# EAGLE schematic v.0.0.1 (EAGLE 5.08)

## Sheet 1 of 7
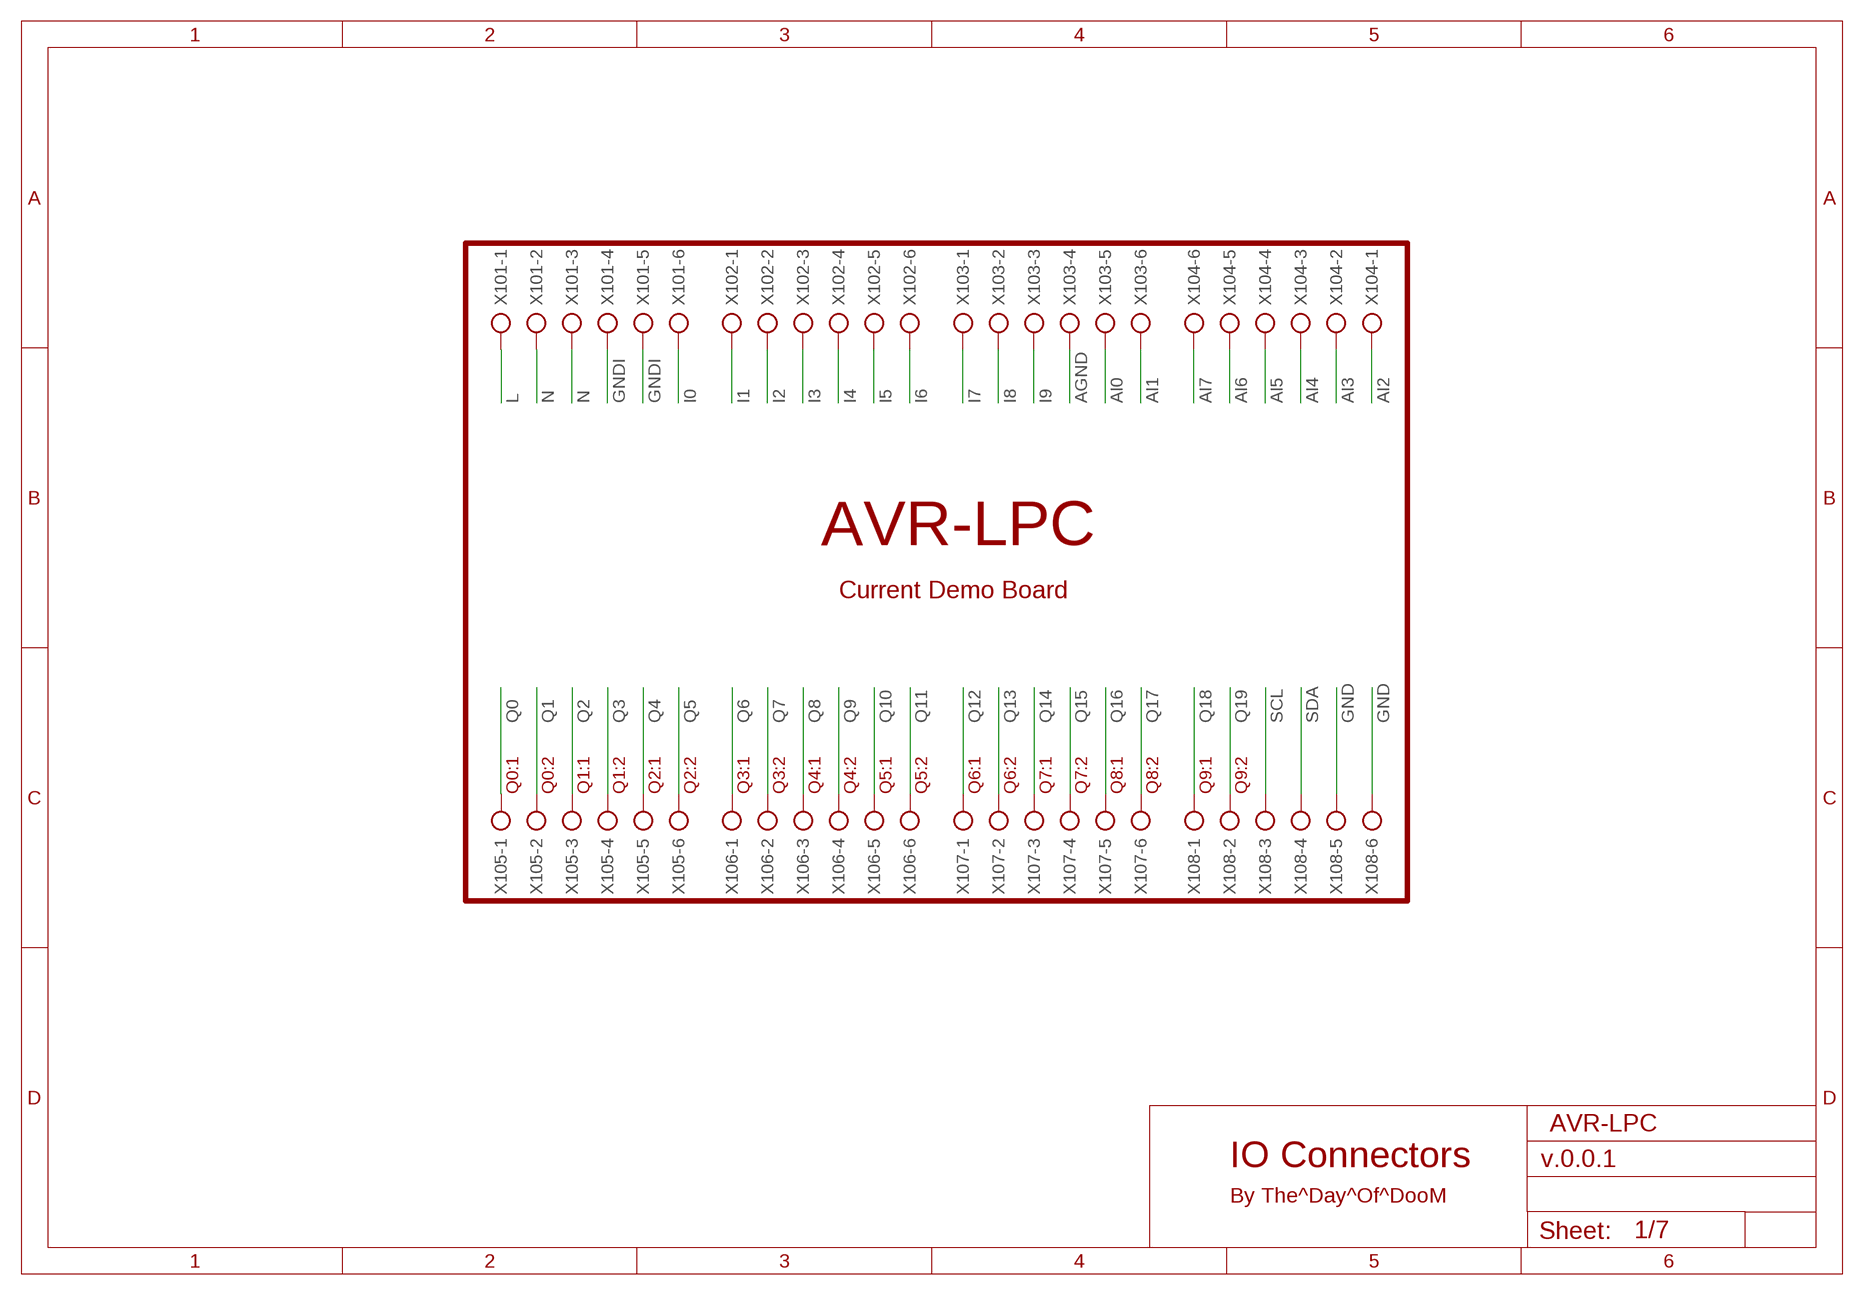
[diagram p0: schematic, sheet 1]

### Parts
X101  AK500/6  [AK500/6]
X102  AK500/6  [AK500/6]
X103  AK500/6  [AK500/6]
X104  AK500/6  [AK500/6]
X105  AK500/6  [AK500/6]
X106  AK500/6  [AK500/6]
X107  AK500/6  [AK500/6]
X108  AK500/6  [AK500/6]

### Nets
AGND: X103.4 ; also sheet 2,7
AI0: X103.5 ; also sheet 7
AI1: X103.6 ; also sheet 7
AI2: X104.1 ; also sheet 7
AI3: X104.2 ; also sheet 7
AI4: X104.3 ; also sheet 7
AI5: X104.4 ; also sheet 7
AI6: X104.5 ; also sheet 7
AI7: X104.6 ; also sheet 7
GND: X108.5 X108.6 ; also sheet 2,3,4,5,6
GNDI: X101.4 X101.5 ; also sheet 2,5
I0: X101.6 ; also sheet 5
I1: X102.1 ; also sheet 5
I2: X102.2 ; also sheet 5
I3: X102.3 ; also sheet 5
I4: X102.4 ; also sheet 5
I5: X102.5 ; also sheet 5
I6: X102.6 ; also sheet 5
I7: X103.1 ; also sheet 5
I8: X103.2 ; also sheet 5
I9: X103.3 ; also sheet 5
L: X101.1 ; also sheet 2
N: X101.2 X101.3 ; also sheet 2
Q0: X105.1 ; also sheet 6
Q1: X105.2 ; also sheet 6
Q2: X105.3 ; also sheet 6
Q3: X105.4 ; also sheet 6
Q4: X105.5 ; also sheet 6
Q5: X105.6 ; also sheet 6
Q6: X106.1 ; also sheet 6
Q7: X106.2 ; also sheet 6
Q8: X106.3 ; also sheet 6
Q9: X106.4 ; also sheet 6
Q10: X106.5 ; also sheet 6
Q11: X106.6 ; also sheet 6
Q12: X107.1 ; also sheet 6
Q13: X107.2 ; also sheet 6
Q14: X107.3 ; also sheet 6
Q15: X107.4 ; also sheet 6
Q16: X107.5 ; also sheet 6
Q17: X107.6 ; also sheet 6
Q18: X108.1 ; also sheet 6
Q19: X108.2 ; also sheet 6
SCL: X108.3 ; also sheet 4
SDA: X108.4 ; also sheet 4

### Notes on the sheet
- AVR-LPC
- Current Demo Board
- Q0:1 | Q0:2 | Q1:1 | Q1:2 | Q2:1 | Q2:2 | Q3:1 | Q3:2 | Q4:1 | Q4:2 | Q5:1 | Q5:2 | Q6:1 | Q6:2 | Q7:1 | Q7:2 | Q8:1 | Q8:2 | Q9:1 | Q9:2
- AVR-LPC
- IO Connectors
- By The^Day^Of^DooM

## Sheet 2 of 7
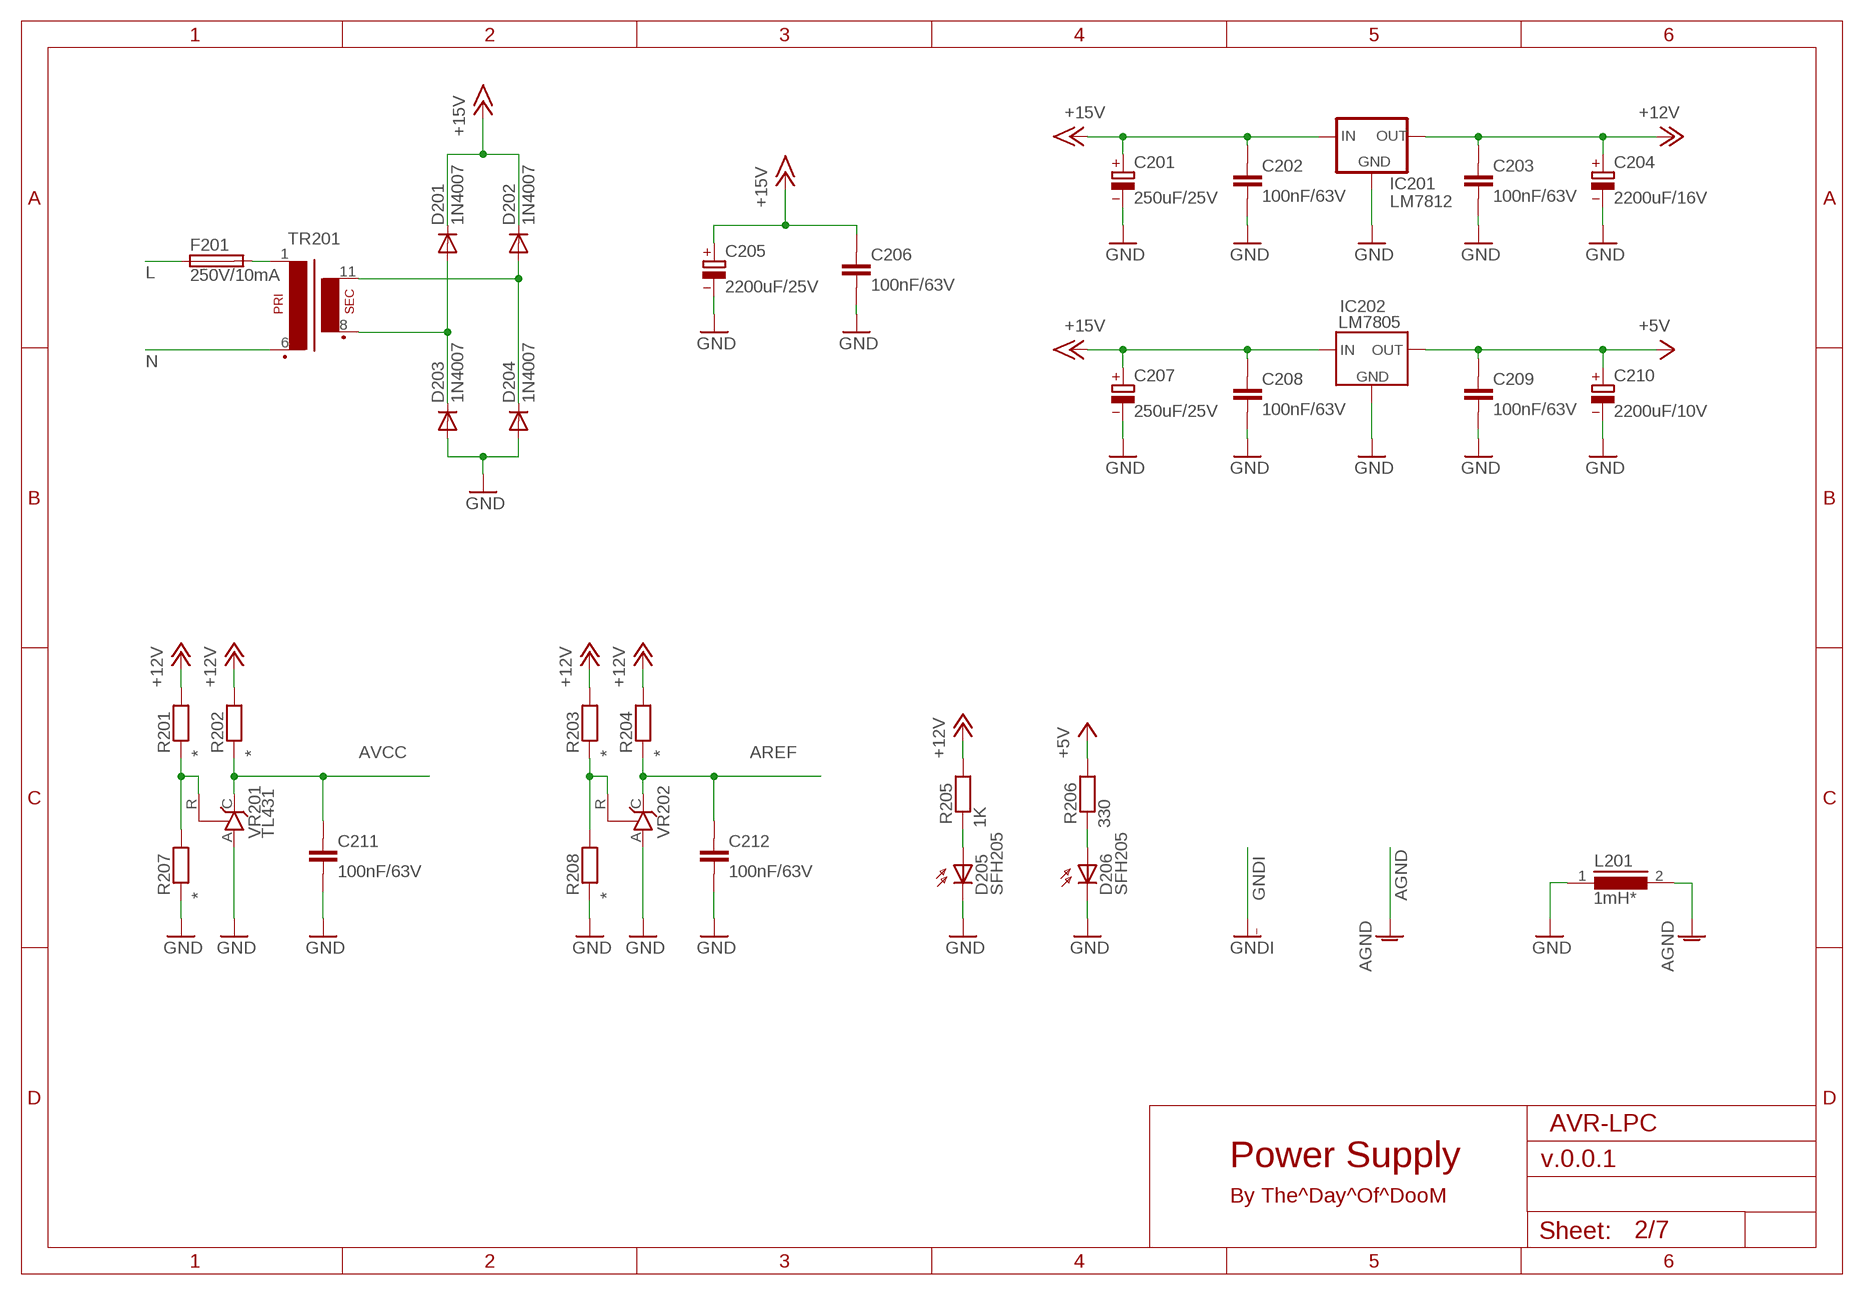
[diagram p1: schematic, sheet 2]

### Parts
C201  250uF/25V  CPOL-EU_Ø250  [CP100X80X24]
C202  100nF/63V  C-EU_3  [C200X100X24]
C203  100nF/63V  C-EU_3  [C200X100X24]
C204  2200uF/16V  CPOL-EU_Ø500Ø400Ø300  [CP500/300X100X24]
C205  2200uF/25V  CPOL-EU_Ø500Ø400Ø300  [CP500/300X100X24]
C206  100nF/63V  C-EU_3  [C200X100X24]
C207  250uF/25V  CPOL-EU_Ø250  [CP100X80X24]
C208  100nF/63V  C-EU_3  [C200X100X24]
C209  100nF/63V  C-EU_3  [C200X100X24]
C210  2200uF/10V  CPOL-EU_Ø500Ø400Ø300  [CP500/300X100X24]
C211  100nF/63V  C-EU_3  [C200X100X24]
C212  100nF/63V  C-EU_3  [C200X100X24]
D201  1N4007  1N4007H  [400X100]
D202  1N4007  1N4007H  [400X100]
D203  1N4007  1N4007H  [400X100]
D204  1N4007  1N4007H  [400X100]
D205  SFH205  [SFH205]
D206  SFH205  [SFH205]
F201  250V/10mA  GSH15  [GSH15]
IC201  LM7812  78XXS  [78XXS]
IC202  LM7805  78XXSC1  [78XX_VERTICAL_COOLER]
L201  1mH*  MICC12  [MICC12]
R201  *  R-EU_2  [R100X86X24]
R202  *  R-EU_2  [R100X86X24]
R203  *  R-EU_2  [R100X86X24]
R204  *  R-EU_2  [R100X86X24]
R205  1K  R-EU_5  [R300X100X24]
R206  330  R-EU_5  [R300X100X24]
R207  *  R-EU_2  [R100X86X24]
R208  *  R-EU_2  [R100X86X24]
TR201  EI48-1  [EI48-1]
VR201  TL431  TL431CLP  [TO92-CLP]
VR202  TL431CLP  [TO92-CLP]

### Nets
+5V: C209.P$1 C210.+ IC202.OUT R206.P$2 ; also sheet 3,4,5
+12V: C203.P$1 C204.+ IC201.OUT R201.P$2 R202.P$2 R203.P$2 R204.P$2 R205.P$2 ; also sheet 7
+15V: C201.+ C202.P$1 C205.+ C206.P$1 C207.+ C208.P$1 D201.C D202.C IC201.IN IC202.IN ; also sheet 6
AGND: L201.2 ; also sheet 1,7
AREF: C212.P$1 R204.P$1 VR202.C ; also sheet 3,4
AVCC: C211.P$1 R202.P$1 VR201.C ; also sheet 3,4
GND: C201.- C202.P$2 C203.P$2 C204.- C205.- C206.P$2 C207.- C208.P$2 C209.P$2 C210.- C211.P$2 C212.P$2 D203.A D204.A D205.K(C) D206.K(C) IC201.GND IC202.GND L201.1 R207.P$1 R208.P$1 VR201.A VR202.A ; also sheet 1,3,4,5,6
L: F201.1 ; also sheet 1
N: TR201.6(P2) ; also sheet 1
N$1: F201.2 TR201.1
N$2: D201.A D203.C TR201.8(S3)
N$3: R201.P$1 R207.P$2 VR201.R
N$5: D202.A D204.C TR201.11(S4)
N$7: R203.P$1 R208.P$2 VR202.R
N$20: D205.A R205.P$1
N$34: D206.A R206.P$1

### Notes on the sheet
- AVR-LPC
- Power Supply
- By The^Day^Of^DooM

## Sheet 3 of 7
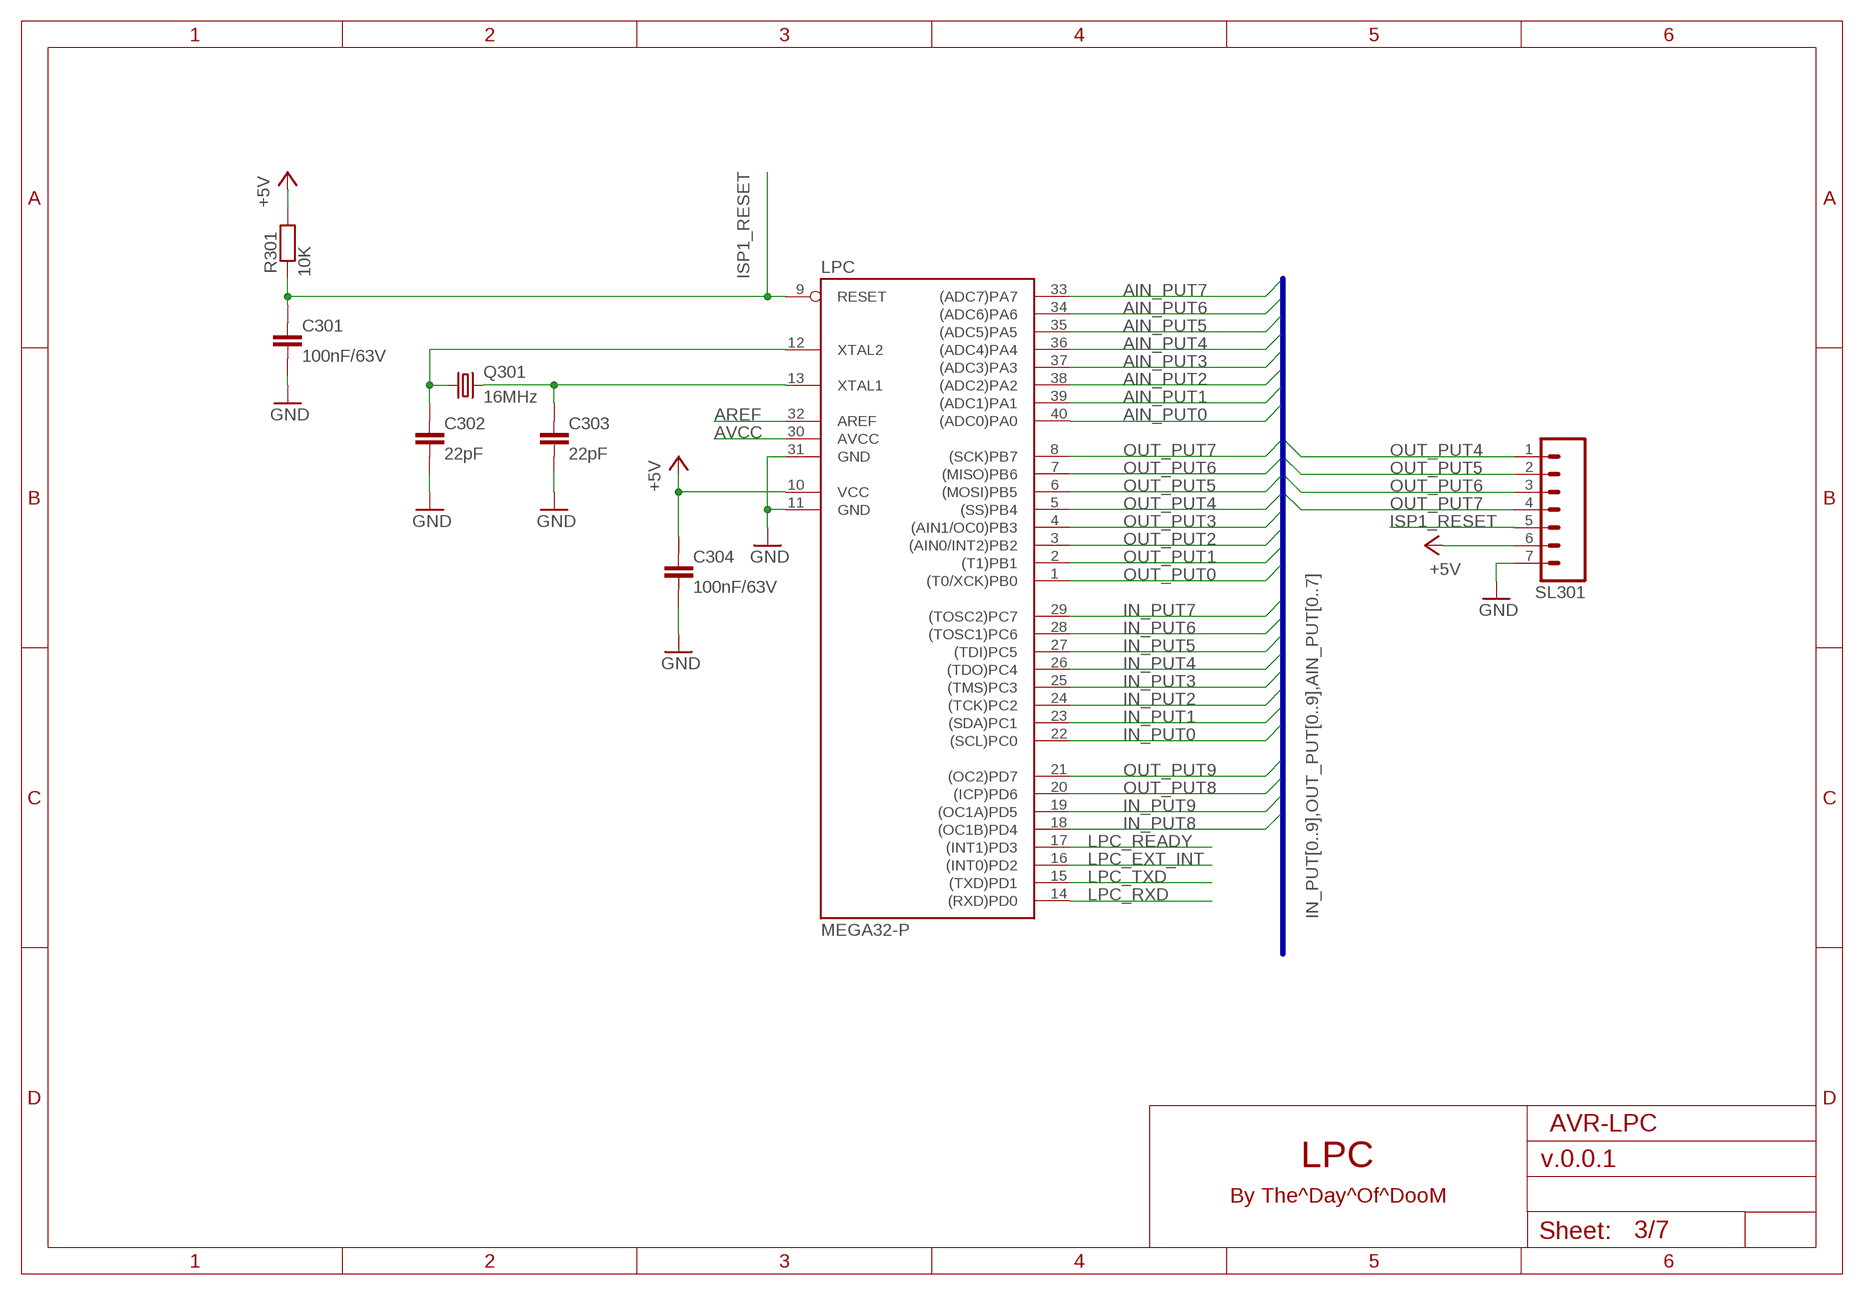
[diagram p2: schematic, sheet 3]

### Parts
C301  100nF/63V  C-EU_3  [C200X100X24]
C302  22pF  C-EU_2  [C100X86X24]
C303  22pF  C-EU_2  [C100X86X24]
C304  100nF/63V  C-EU_3  [C200X100X24]
LPC  MEGA32-P  [DIL40]
Q301  16MHz  CRYSTALHC49U-V  [HC49U-V]
R301  10K  R-EU_2  [R100X86X24]
SL301  M07  [07P]

### Nets
+5V: C304.P$1 LPC.10(VCC) R301.P$2 SL301.6 ; also sheet 2,4,5
AIN_PUT0: LPC.40((ADC0)PA0) ; also sheet 7
AIN_PUT1: LPC.39((ADC1)PA1) ; also sheet 7
AIN_PUT2: LPC.38((ADC2)PA2) ; also sheet 7
AIN_PUT3: LPC.37((ADC3)PA3) ; also sheet 7
AIN_PUT4: LPC.36((ADC4)PA4) ; also sheet 7
AIN_PUT5: LPC.35((ADC5)PA5) ; also sheet 7
AIN_PUT6: LPC.34((ADC6)PA6) ; also sheet 7
AIN_PUT7: LPC.33((ADC7)PA7) ; also sheet 7
AREF: LPC.32(AREF) ; also sheet 2,4
AVCC: LPC.30(AVCC) ; also sheet 2,4
GND: C301.P$2 C302.P$2 C303.P$2 C304.P$2 LPC.11(GND) LPC.31(GND) SL301.7 ; also sheet 1,2,4,5,6
IN_PUT0: LPC.22((SCL)PC0) ; also sheet 5
IN_PUT1: LPC.23((SDA)PC1) ; also sheet 5
IN_PUT2: LPC.24((TCK)PC2) ; also sheet 5
IN_PUT3: LPC.25((TMS)PC3) ; also sheet 5
IN_PUT4: LPC.26((TDO)PC4) ; also sheet 5
IN_PUT5: LPC.27((TDI)PC5) ; also sheet 5
IN_PUT6: LPC.28((TOSC1)PC6) ; also sheet 5
IN_PUT7: LPC.29((TOSC2)PC7) ; also sheet 5
IN_PUT8: LPC.18((OC1B)PD4) ; also sheet 5
IN_PUT9: LPC.19((OC1A)PD5) ; also sheet 5
ISP1_RESET: C301.P$1 LPC.9(RESET) R301.P$1 SL301.5
LPC_EXT_INT: LPC.16((INT0)PD2) ; also sheet 4
LPC_READY: LPC.17((INT1)PD3) ; also sheet 4
LPC_RXD: LPC.14((RXD)PD0) ; also sheet 4
LPC_TXD: LPC.15((TXD)PD1) ; also sheet 4
N$6: C302.P$1 LPC.12(XTAL2) Q301.1
N$8: C303.P$1 LPC.13(XTAL1) Q301.2
OUT_PUT0: LPC.1((T0/XCK)PB0) ; also sheet 6
OUT_PUT1: LPC.2((T1)PB1) ; also sheet 6
OUT_PUT2: LPC.3((AIN0/INT2)PB2) ; also sheet 6
OUT_PUT3: LPC.4((AIN1/OC0)PB3) ; also sheet 6
OUT_PUT4: LPC.5((SS)PB4) SL301.1 ; also sheet 6
OUT_PUT5: LPC.6((MOSI)PB5) SL301.2 ; also sheet 6
OUT_PUT6: LPC.7((MISO)PB6) SL301.3 ; also sheet 6
OUT_PUT7: LPC.8((SCK)PB7) SL301.4 ; also sheet 6
OUT_PUT8: LPC.20((ICP)PD6) ; also sheet 6
OUT_PUT9: LPC.21((OC2)PD7) ; also sheet 6

### Buses
IN_PUT[0..9],OUT_PUT[0..9],AIN_PUT[0..7]

### Notes on the sheet
- AVR-LPC
- LPC
- By The^Day^Of^DooM

## Sheet 4 of 7
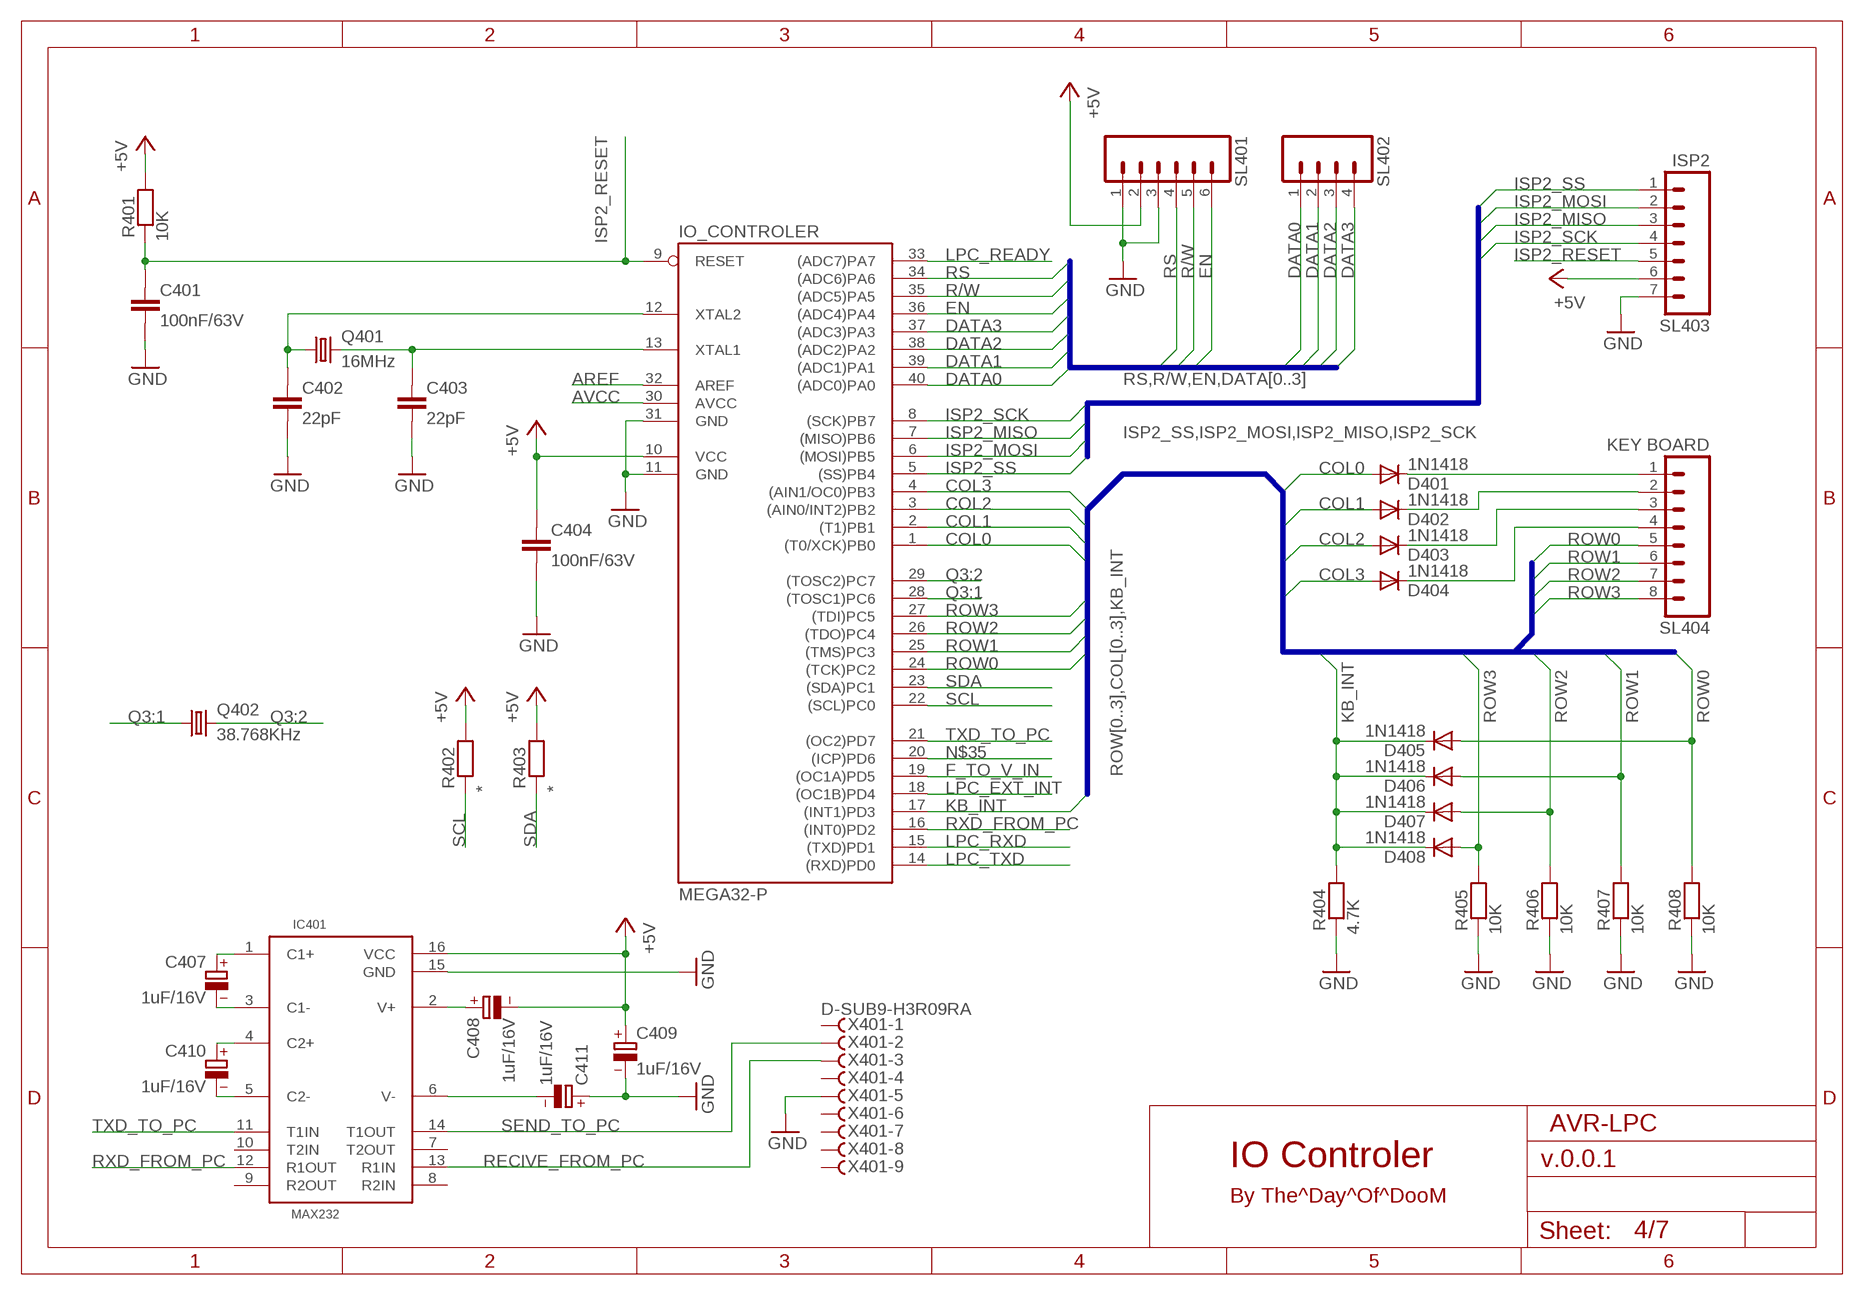
[diagram p3: schematic, sheet 4]

### Parts
C401  100nF/63V  C-EU_3  [C200X100X24]
C402  22pF  C-EU_2  [C100X86X24]
C403  22pF  C-EU_2  [C100X86X24]
C404  100nF/63V  C-EU_3  [C200X100X24]
C407  1uF/16V  CPOL-EU_Ø250  [CP100X80X24]
C408  1uF/16V  CPOL-EU_Ø250  [CP100X80X24]
C409  1uF/16V  CPOL-EU_Ø250  [CP100X80X24]
C410  1uF/16V  CPOL-EU_Ø250  [CP100X80X24]
C411  1uF/16V  CPOL-EU_Ø250  [CP100X80X24]
D401  1N1418  DIODE-D-7.5  [D-7.5]
D402  1N1418  DIODE-D-7.5  [D-7.5]
D403  1N1418  DIODE-D-7.5  [D-7.5]
D404  1N1418  DIODE-D-7.5  [D-7.5]
D405  1N1418  DIODE-D-7.5  [D-7.5]
D406  1N1418  DIODE-D-7.5  [D-7.5]
D407  1N1418  DIODE-D-7.5  [D-7.5]
D408  1N1418  DIODE-D-7.5  [D-7.5]
IC401  MAX232  [DIL16]
IO_CONTROLER  MEGA32-P  [DIL40]
Q401  16MHz  CRYSTALHC49U-V  [HC49U-V]
Q402  38.768KHz  CRYSTALTC26V  [TC26V]
R401  10K  R-EU_2  [R100X86X24]
R402  *  R-EU_5  [R300X100X24]
R403  *  R-EU_5  [R300X100X24]
R404  4.7K  R-EU_1  [R100X80X24]
R405  10K  R-EU_2  [R100X86X24]
R406  10K  R-EU_2  [R100X86X24]
R407  10K  R-EU_2  [R100X86X24]
R408  10K  R-EU_2  [R100X86X24]
SL401  M06  [06P]
SL402  M04  [04P]
SL403  ISP2  M07  [07P]
SL404  KEY BOARD  M08  [08P]
X401  D-SUB9-H3R09RA  [H3R09RA]

### Nets
+5V: C404.P$1 C408.- C409.+ IC401.16(VCC) IO_CONTROLER.10(VCC) R401.P$2 R402.P$2 R403.P$2 SL401.2 SL403.6 ; also sheet 2,3,5
AREF: IO_CONTROLER.32(AREF) ; also sheet 2,3
AVCC: IO_CONTROLER.30(AVCC) ; also sheet 2,3
COL0: D401.A IO_CONTROLER.1((T0/XCK)PB0)
COL1: D402.A IO_CONTROLER.2((T1)PB1)
COL2: D403.A IO_CONTROLER.3((AIN0/INT2)PB2)
COL3: D404.A IO_CONTROLER.4((AIN1/OC0)PB3)
DATA0: IO_CONTROLER.40((ADC0)PA0) SL402.1
DATA1: IO_CONTROLER.39((ADC1)PA1) SL402.2
DATA2: IO_CONTROLER.38((ADC2)PA2) SL402.3
DATA3: IO_CONTROLER.37((ADC3)PA3) SL402.4
EN: IO_CONTROLER.36((ADC4)PA4) SL401.6
F_TO_V_IN: IO_CONTROLER.19((OC1A)PD5)
GND: C401.P$2 C402.P$2 C403.P$2 C404.P$2 C409.- C411.+ IC401.15(GND) IO_CONTROLER.11(GND) IO_CONTROLER.31(GND) R404.P$1 R405.P$1 R406.P$1 R407.P$1 R408.P$1 SL401.1 SL401.3 SL403.7 X401.5 ; also sheet 1,2,3,5,6
ISP2_MISO: IO_CONTROLER.7((MISO)PB6) SL403.3
ISP2_MOSI: IO_CONTROLER.6((MOSI)PB5) SL403.2
ISP2_RESET: C401.P$1 IO_CONTROLER.9(RESET) R401.P$1 SL403.5
ISP2_SCK: IO_CONTROLER.8((SCK)PB7) SL403.4
ISP2_SS: IO_CONTROLER.5((SS)PB4) SL403.1
KB_INT: D405.C D406.C D407.C D408.C IO_CONTROLER.17((INT1)PD3) R404.P$2
LPC_EXT_INT: IO_CONTROLER.18((OC1B)PD4) ; also sheet 3
LPC_READY: IO_CONTROLER.33((ADC7)PA7) ; also sheet 3
LPC_RXD: IO_CONTROLER.15((TXD)PD1) ; also sheet 3
LPC_TXD: IO_CONTROLER.14((RXD)PD0) ; also sheet 3
N$4: C407.- IC401.3(C1-)
N$9: C407.+ IC401.1(C1+)
N$10: C402.P$1 IO_CONTROLER.12(XTAL2) Q401.1
N$11: C403.P$1 IO_CONTROLER.13(XTAL1) Q401.2
N$12: C410.- IC401.5(C2-)
N$13: C410.+ IC401.4(C2+)
N$14: C408.+ IC401.2(V+)
N$15: D401.C SL404.1
N$16: D402.C SL404.2
N$17: D403.C SL404.3
N$18: D404.C SL404.4
N$19: C411.- IC401.6(V-)
N$35: IO_CONTROLER.20((ICP)PD6)
Q3:1: IO_CONTROLER.28((TOSC1)PC6) Q402.1
Q3:2: IO_CONTROLER.29((TOSC2)PC7) Q402.2
R/W: IO_CONTROLER.35((ADC5)PA5) SL401.5
RECIVE_FROM_PC: IC401.13(R1IN) X401.3
ROW0: D405.A IO_CONTROLER.24((TCK)PC2) R408.P$2 SL404.5
ROW1: D406.A IO_CONTROLER.25((TMS)PC3) R407.P$2 SL404.6
ROW2: D407.A IO_CONTROLER.26((TDO)PC4) R406.P$2 SL404.7
ROW3: D408.A IO_CONTROLER.27((TDI)PC5) R405.P$2 SL404.8
RS: IO_CONTROLER.34((ADC6)PA6) SL401.4
RXD_FROM_PC: IC401.12(R1OUT) IO_CONTROLER.16((INT0)PD2)
SCL: IO_CONTROLER.22((SCL)PC0) R402.P$1 ; also sheet 1
SDA: IO_CONTROLER.23((SDA)PC1) R403.P$1 ; also sheet 1
SEND_TO_PC: IC401.14(T1OUT) X401.2
TXD_TO_PC: IC401.11(T1IN) IO_CONTROLER.21((OC2)PD7)
Unconnected: IC401.7(T2OUT) IC401.8(R2IN) IC401.9(R2OUT) IC401.10(T2IN) X401.1 X401.4 X401.6 X401.7 X401.8 X401.9

### Buses
ROW[0..3],COL[0..3],KB_INT
RS,R/W,EN,DATA[0..3]
ISP2_SS,ISP2_MOSI,ISP2_MISO,ISP2_SCK

### Notes on the sheet
- AVR-LPC
- IO Controler
- By The^Day^Of^DooM

## Sheet 5 of 7
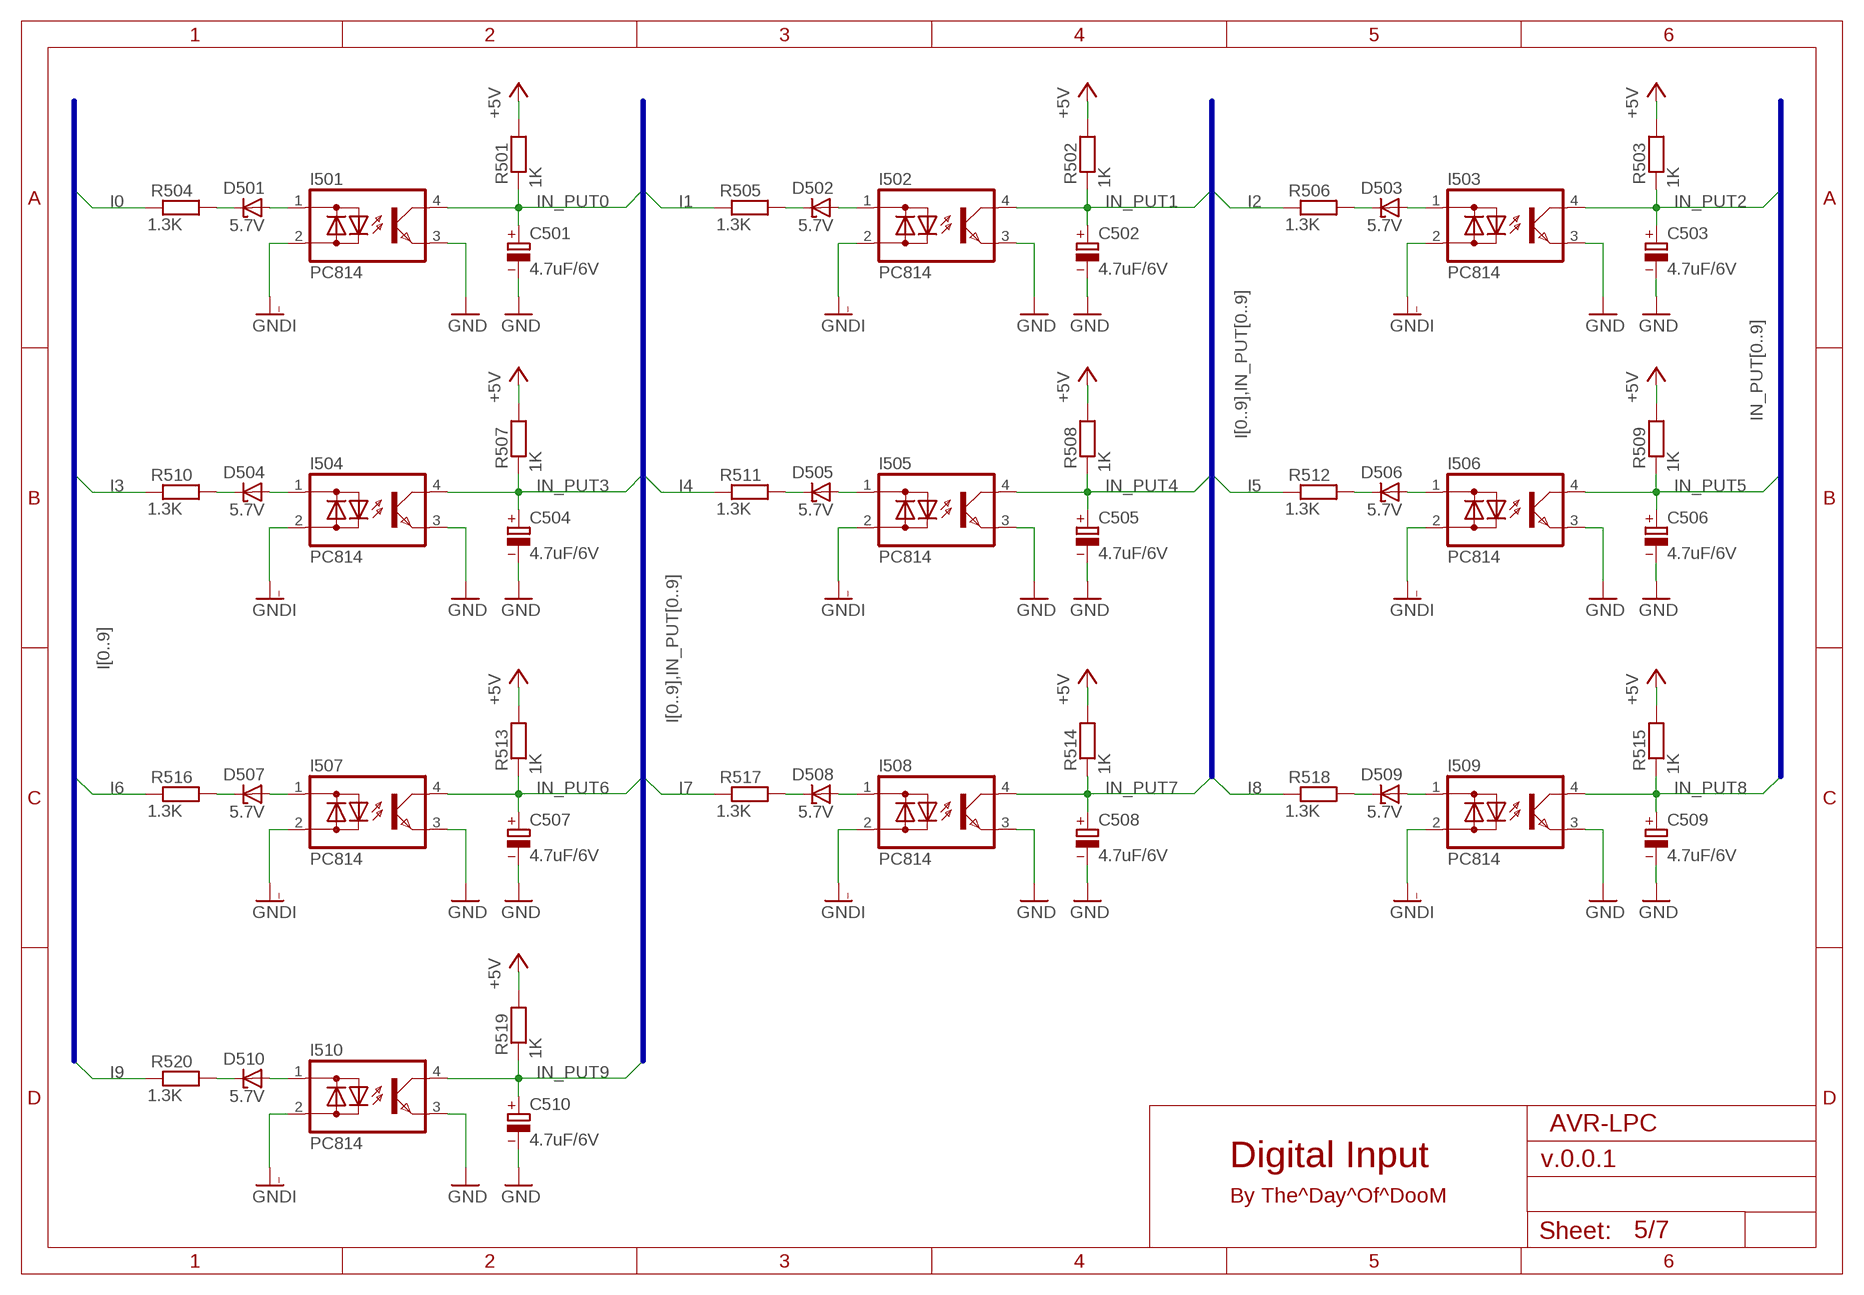
[diagram p4: schematic, sheet 5]

### Parts
C501  4.7uF/6V  CPOL-EU_Ø250  [CP100X80X24]
C502  4.7uF/6V  CPOL-EU_Ø250  [CP100X80X24]
C503  4.7uF/6V  CPOL-EU_Ø250  [CP100X80X24]
C504  4.7uF/6V  CPOL-EU_Ø250  [CP100X80X24]
C505  4.7uF/6V  CPOL-EU_Ø250  [CP100X80X24]
C506  4.7uF/6V  CPOL-EU_Ø250  [CP100X80X24]
C507  4.7uF/6V  CPOL-EU_Ø250  [CP100X80X24]
C508  4.7uF/6V  CPOL-EU_Ø250  [CP100X80X24]
C509  4.7uF/6V  CPOL-EU_Ø250  [CP100X80X24]
C510  4.7uF/6V  CPOL-EU_Ø250  [CP100X80X24]
D501  5.7V  ZENER-DIODEZD-2.5  [ZDIO-2.5]
D502  5.7V  ZENER-DIODEZD-2.5  [ZDIO-2.5]
D503  5.7V  ZENER-DIODEZD-2.5  [ZDIO-2.5]
D504  5.7V  ZENER-DIODEZD-2.5  [ZDIO-2.5]
D505  5.7V  ZENER-DIODEZD-2.5  [ZDIO-2.5]
D506  5.7V  ZENER-DIODEZD-2.5  [ZDIO-2.5]
D507  5.7V  ZENER-DIODEZD-2.5  [ZDIO-2.5]
D508  5.7V  ZENER-DIODEZD-2.5  [ZDIO-2.5]
D509  5.7V  ZENER-DIODEZD-2.5  [ZDIO-2.5]
D510  5.7V  ZENER-DIODEZD-2.5  [ZDIO-2.5]
I501  PC814  [DIL04]
I502  PC814  [DIL04]
I503  PC814  [DIL04]
I504  PC814  [DIL04]
I505  PC814  [DIL04]
I506  PC814  [DIL04]
I507  PC814  [DIL04]
I508  PC814  [DIL04]
I509  PC814  [DIL04]
I510  PC814  [DIL04]
R501  1K  R-EU_2  [R100X86X24]
R502  1K  R-EU_2  [R100X86X24]
R503  1K  R-EU_2  [R100X86X24]
R504  1.3K  R-EU_2  [R100X86X24]
R505  1.3K  R-EU_2  [R100X86X24]
R506  1.3K  R-EU_2  [R100X86X24]
R507  1K  R-EU_2  [R100X86X24]
R508  1K  R-EU_2  [R100X86X24]
R509  1K  R-EU_2  [R100X86X24]
R510  1.3K  R-EU_2  [R100X86X24]
R511  1.3K  R-EU_2  [R100X86X24]
R512  1.3K  R-EU_2  [R100X86X24]
R513  1K  R-EU_2  [R100X86X24]
R514  1K  R-EU_2  [R100X86X24]
R515  1K  R-EU_2  [R100X86X24]
R516  1.3K  R-EU_2  [R100X86X24]
R517  1.3K  R-EU_2  [R100X86X24]
R518  1.3K  R-EU_2  [R100X86X24]
R519  1K  R-EU_2  [R100X86X24]
R520  1.3K  R-EU_2  [R100X86X24]

### Nets
+5V: R501.P$2 R502.P$2 R503.P$2 R507.P$2 R508.P$2 R509.P$2 R513.P$2 R514.P$2 R515.P$2 R519.P$2 ; also sheet 2,3,4
GND: C501.- C502.- C503.- C504.- C505.- C506.- C507.- C508.- C509.- C510.- I501.3(E) I502.3(E) I503.3(E) I504.3(E) I505.3(E) I506.3(E) I507.3(E) I508.3(E) I509.3(E) I510.3(E) ; also sheet 1,2,3,4,6
GNDI: I501.2(AC2) I502.2(AC2) I503.2(AC2) I504.2(AC2) I505.2(AC2) I506.2(AC2) I507.2(AC2) I508.2(AC2) I509.2(AC2) I510.2(AC2) ; also sheet 1,2
I0: R504.P$1 ; also sheet 1
I1: R505.P$1 ; also sheet 1
I2: R506.P$1 ; also sheet 1
I3: R510.P$1 ; also sheet 1
I4: R511.P$1 ; also sheet 1
I5: R512.P$1 ; also sheet 1
I6: R516.P$1 ; also sheet 1
I7: R517.P$1 ; also sheet 1
I8: R518.P$1 ; also sheet 1
I9: R520.P$1 ; also sheet 1
IN_PUT0: C501.+ I501.4(C) R501.P$1 ; also sheet 3
IN_PUT1: C502.+ I502.4(C) R502.P$1 ; also sheet 3
IN_PUT2: C503.+ I503.4(C) R503.P$1 ; also sheet 3
IN_PUT3: C504.+ I504.4(C) R507.P$1 ; also sheet 3
IN_PUT4: C505.+ I505.4(C) R508.P$1 ; also sheet 3
IN_PUT5: C506.+ I506.4(C) R509.P$1 ; also sheet 3
IN_PUT6: C507.+ I507.4(C) R513.P$1 ; also sheet 3
IN_PUT7: C508.+ I508.4(C) R514.P$1 ; also sheet 3
IN_PUT8: C509.+ I509.4(C) R515.P$1 ; also sheet 3
IN_PUT9: C510.+ I510.4(C) R519.P$1 ; also sheet 3
N$22: D501.C R504.P$2
N$23: D501.A I501.1(AC1)
N$26: D504.C R510.P$2
N$27: D504.A I504.1(AC1)
N$28: D507.C R516.P$2
N$29: D507.A I507.1(AC1)
N$30: D510.C R520.P$2
N$31: D510.A I510.1(AC1)
N$36: D508.C R517.P$2
N$37: D508.A I508.1(AC1)
N$39: D505.C R511.P$2
N$40: D505.A I505.1(AC1)
N$43: D502.C R505.P$2
N$44: D502.A I502.1(AC1)
N$45: D509.C R518.P$2
N$46: D509.A I509.1(AC1)
N$47: D506.C R512.P$2
N$48: D506.A I506.1(AC1)
N$51: D503.C R506.P$2
N$52: D503.A I503.1(AC1)

### Buses
I[0..9]
I[0..9],IN_PUT[0..9]
IN_PUT[0..9]

### Notes on the sheet
- AVR-LPC
- Digital Input
- By The^Day^Of^DooM

## Sheet 6 of 7
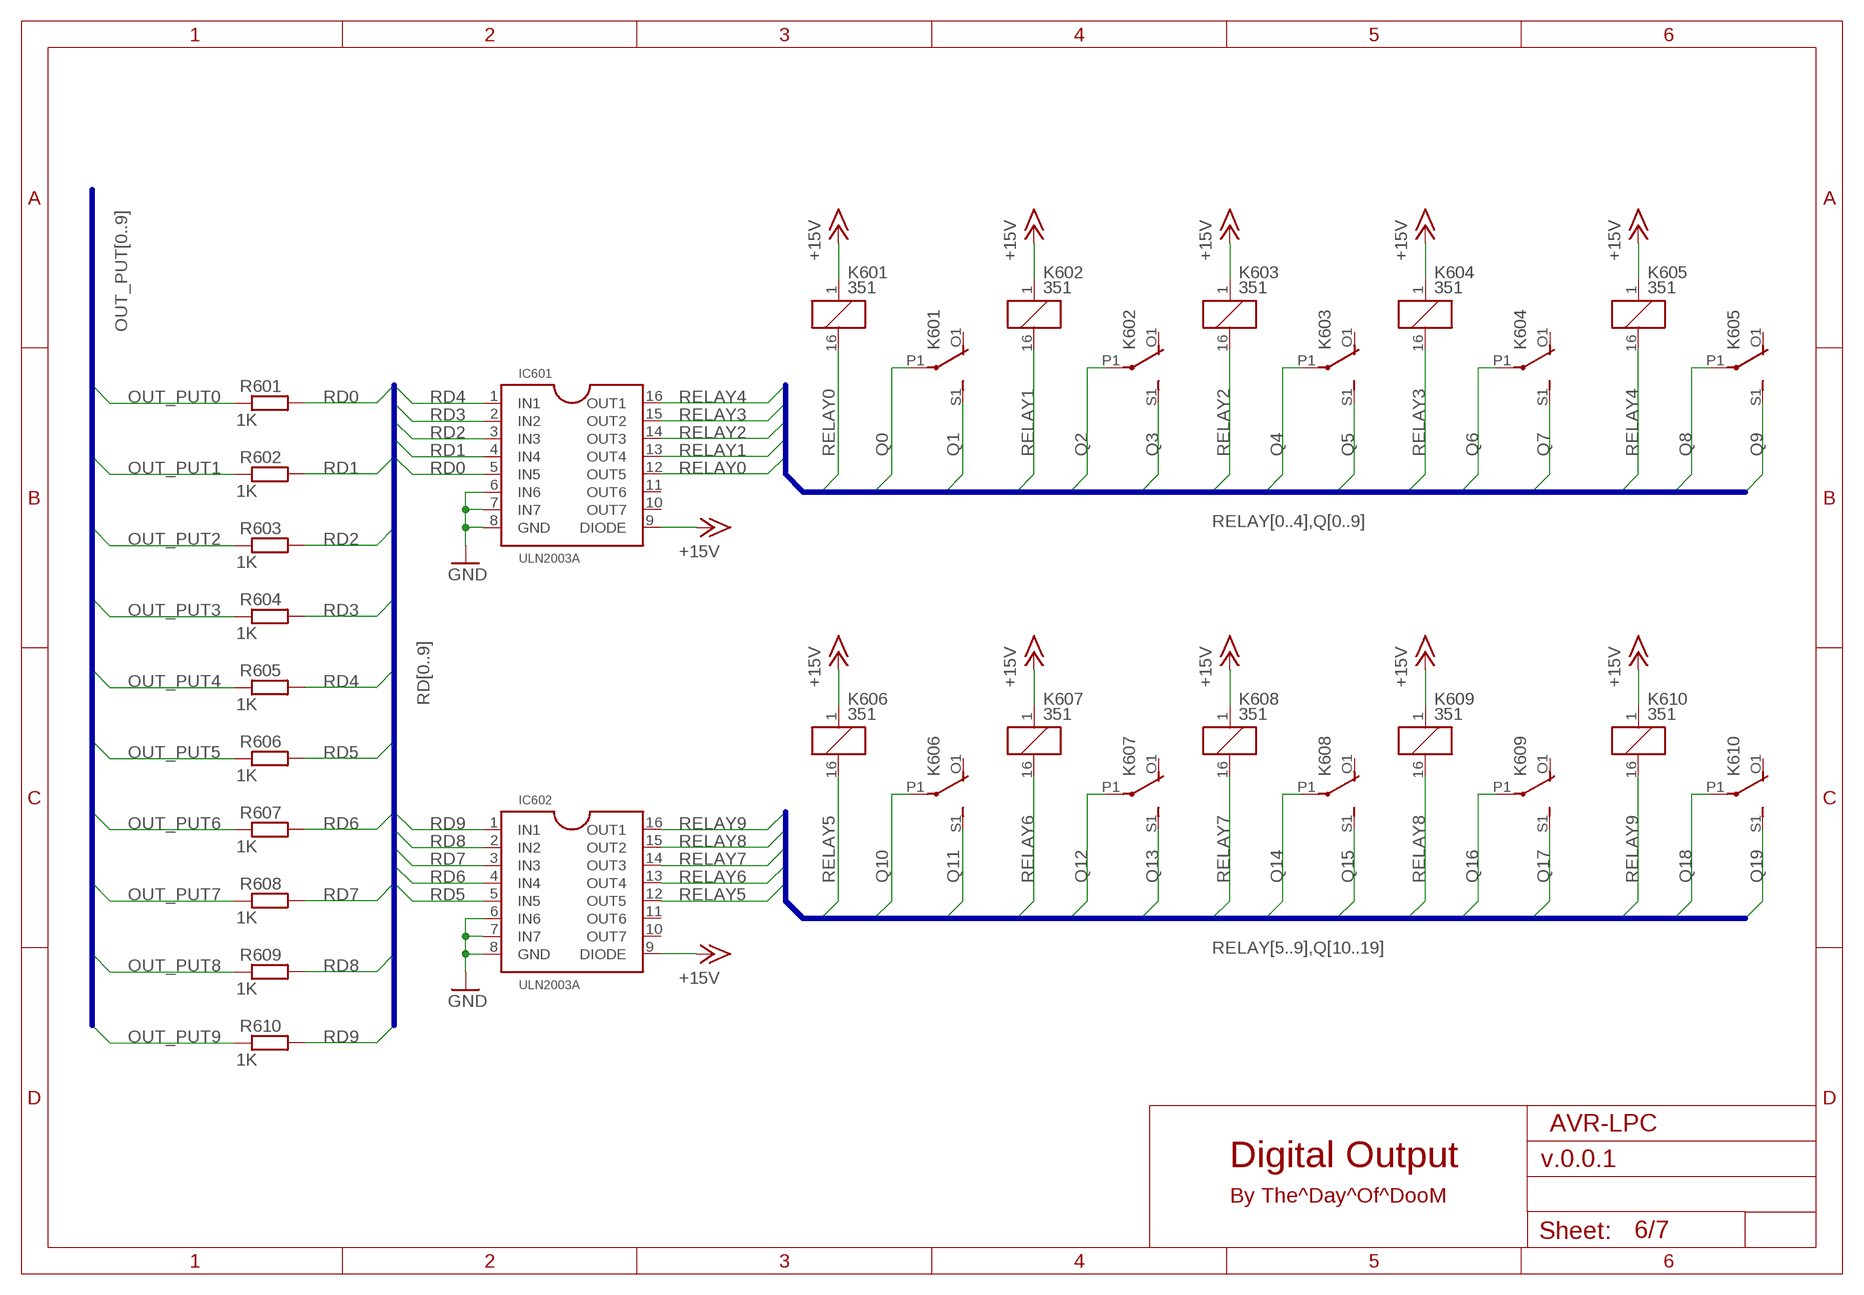
[diagram p5: schematic, sheet 6]

### Parts
IC601  ULN2003A  [DIL16]
IC602  ULN2003A  [DIL16]
K601  351  [351]
K602  351  [351]
K603  351  [351]
K604  351  [351]
K605  351  [351]
K606  351  [351]
K607  351  [351]
K608  351  [351]
K609  351  [351]
K610  351  [351]
R601  1K  R-EU_2  [R100X86X24]
R602  1K  R-EU_2  [R100X86X24]
R603  1K  R-EU_2  [R100X86X24]
R604  1K  R-EU_2  [R100X86X24]
R605  1K  R-EU_2  [R100X86X24]
R606  1K  R-EU_2  [R100X86X24]
R607  1K  R-EU_2  [R100X86X24]
R608  1K  R-EU_2  [R100X86X24]
R609  1K  R-EU_2  [R100X86X24]
R610  1K  R-EU_6  [R400X100X24]

### Nets
+15V: IC601.9(DIODE) IC602.9(DIODE) K601.1 K602.1 K603.1 K604.1 K605.1 K606.1 K607.1 K608.1 K609.1 K610.1 ; also sheet 2
GND: IC601.6(IN6) IC601.7(IN7) IC601.8(GND) IC602.6(IN6) IC602.7(IN7) IC602.8(GND) ; also sheet 1,2,3,4,5
OUT_PUT0: R601.P$1 ; also sheet 3
OUT_PUT1: R602.P$1 ; also sheet 3
OUT_PUT2: R603.P$1 ; also sheet 3
OUT_PUT3: R604.P$1 ; also sheet 3
OUT_PUT4: R605.P$1 ; also sheet 3
OUT_PUT5: R606.P$1 ; also sheet 3
OUT_PUT6: R607.P$1 ; also sheet 3
OUT_PUT7: R608.P$1 ; also sheet 3
OUT_PUT8: R609.P$1 ; also sheet 3
OUT_PUT9: R610.P$1 ; also sheet 3
Q0: K601.P1(2:P) ; also sheet 1
Q1: K601.S1(2:S) ; also sheet 1
Q2: K602.P1(2:P) ; also sheet 1
Q3: K602.S1(2:S) ; also sheet 1
Q4: K603.P1(2:P) ; also sheet 1
Q5: K603.S1(2:S) ; also sheet 1
Q6: K604.P1(2:P) ; also sheet 1
Q7: K604.S1(2:S) ; also sheet 1
Q8: K605.P1(2:P) ; also sheet 1
Q9: K605.S1(2:S) ; also sheet 1
Q10: K606.P1(2:P) ; also sheet 1
Q11: K606.S1(2:S) ; also sheet 1
Q12: K607.P1(2:P) ; also sheet 1
Q13: K607.S1(2:S) ; also sheet 1
Q14: K608.P1(2:P) ; also sheet 1
Q15: K608.S1(2:S) ; also sheet 1
Q16: K609.P1(2:P) ; also sheet 1
Q17: K609.S1(2:S) ; also sheet 1
Q18: K610.P1(2:P) ; also sheet 1
Q19: K610.S1(2:S) ; also sheet 1
RD0: IC601.5(IN5) R601.P$2
RD1: IC601.4(IN4) R602.P$2
RD2: IC601.3(IN3) R603.P$2
RD3: IC601.2(IN2) R604.P$2
RD4: IC601.1(IN1) R605.P$2
RD5: IC602.5(IN5) R606.P$2
RD6: IC602.4(IN4) R607.P$2
RD7: IC602.3(IN3) R608.P$2
RD8: IC602.2(IN2) R609.P$2
RD9: IC602.1(IN1) R610.P$2
RELAY0: IC601.12(OUT5) K601.16
RELAY1: IC601.13(OUT4) K602.16
RELAY2: IC601.14(OUT3) K603.16
RELAY3: IC601.15(OUT2) K604.16
RELAY4: IC601.16(OUT1) K605.16
RELAY5: IC602.12(OUT5) K606.16
RELAY6: IC602.13(OUT4) K607.16
RELAY7: IC602.14(OUT3) K608.16
RELAY8: IC602.15(OUT2) K609.16
RELAY9: IC602.16(OUT1) K610.16
Unconnected: IC601.10(OUT7) IC601.11(OUT6) IC602.10(OUT7) IC602.11(OUT6) K601.O1(2:O) K601.O2(3:O) K601.P2(3:P) K601.S2(3:S) K602.O1(2:O) K602.O2(3:O) K602.P2(3:P) K602.S2(3:S) K603.O1(2:O) K603.O2(3:O) K603.P2(3:P) K603.S2(3:S) K604.O1(2:O) K604.O2(3:O) K604.P2(3:P) K604.S2(3:S) K605.O1(2:O) K605.O2(3:O) K605.P2(3:P) K605.S2(3:S) K606.O1(2:O) K606.O2(3:O) K606.P2(3:P) K606.S2(3:S) K607.O1(2:O) K607.O2(3:O) K607.P2(3:P) K607.S2(3:S) K608.O1(2:O) K608.O2(3:O) K608.P2(3:P) K608.S2(3:S) K609.O1(2:O) K609.O2(3:O) K609.P2(3:P) K609.S2(3:S) K610.O1(2:O) K610.O2(3:O) K610.P2(3:P) K610.S2(3:S)

### Buses
RD[0..9]
OUT_PUT[0..9]
RELAY[0..4],Q[0..9]
RELAY[5..9],Q[10..19]

### Notes on the sheet
- AVR-LPC
- Digital Output
- By The^Day^Of^DooM

## Sheet 7 of 7
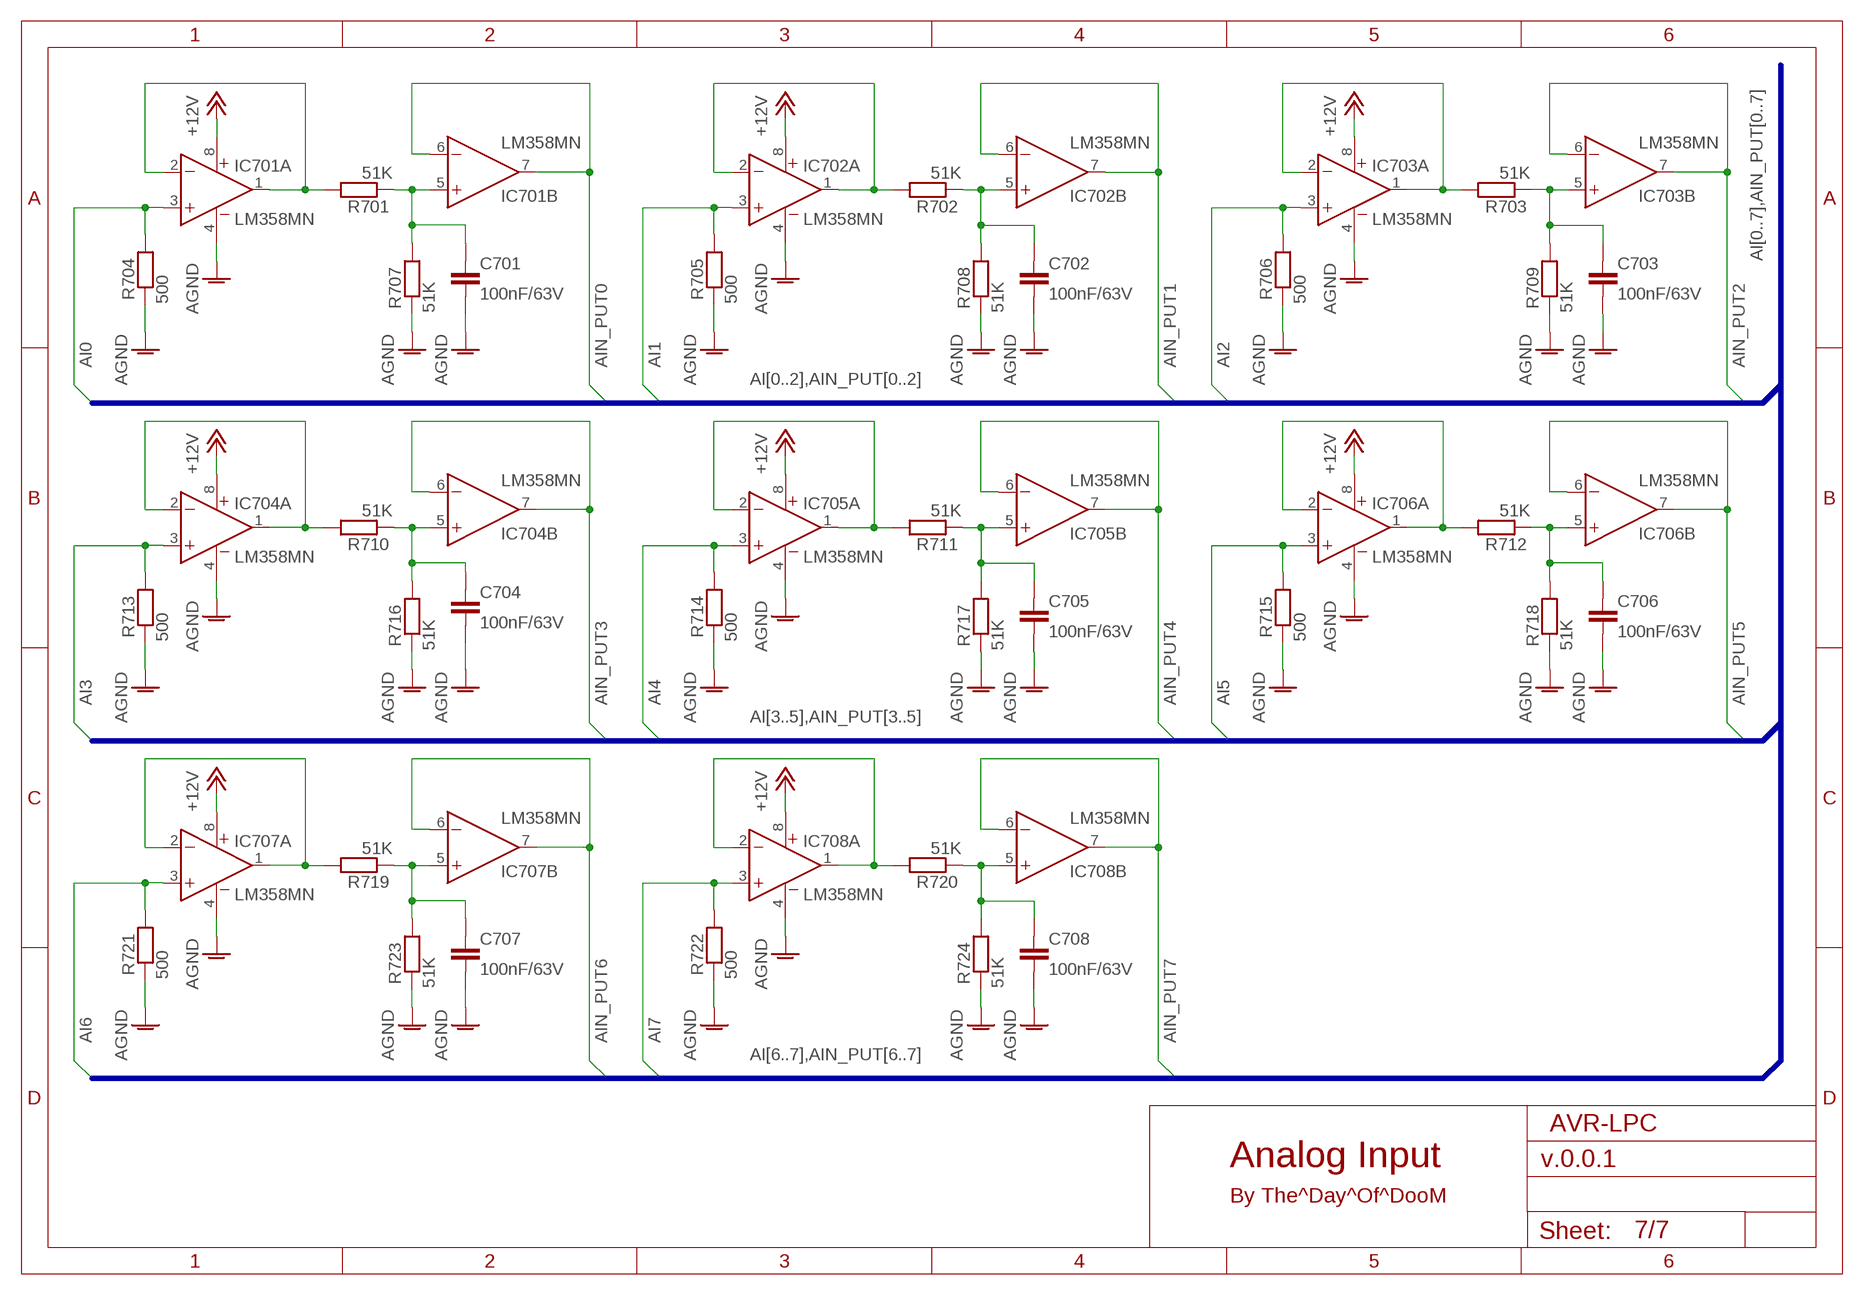
[diagram p6: schematic, sheet 7]

### Parts
C701  100nF/63V  C-EU_3  [C200X100X24]
C702  100nF/63V  C-EU_3  [C200X100X24]
C703  100nF/63V  C-EU_3  [C200X100X24]
C704  100nF/63V  C-EU_3  [C200X100X24]
C705  100nF/63V  C-EU_3  [C200X100X24]
C706  100nF/63V  C-EU_3  [C200X100X24]
C707  100nF/63V  C-EU_3  [C200X100X24]
C708  100nF/63V  C-EU_3  [C200X100X24]
IC701  LM358MN  [DIL8]
IC702  LM358MN  [DIL8]
IC703  LM358MN  [DIL8]
IC704  LM358MN  [DIL8]
IC705  LM358MN  [DIL8]
IC706  LM358MN  [DIL8]
IC707  LM358MN  [DIL8]
IC708  LM358MN  [DIL8]
R701  51K  R-EU_5  [R300X100X24]
R702  51K  R-EU_5  [R300X100X24]
R703  51K  R-EU_5  [R300X100X24]
R704  500  R-EU_2  [R100X86X24]
R705  500  R-EU_2  [R100X86X24]
R706  500  R-EU_2  [R100X86X24]
R707  51K  R-EU_5  [R300X100X24]
R708  51K  R-EU_5  [R300X100X24]
R709  51K  R-EU_5  [R300X100X24]
R710  51K  R-EU_5  [R300X100X24]
R711  51K  R-EU_5  [R300X100X24]
R712  51K  R-EU_5  [R300X100X24]
R713  500  R-EU_2  [R100X86X24]
R714  500  R-EU_2  [R100X86X24]
R715  500  R-EU_2  [R100X86X24]
R716  51K  R-EU_5  [R300X100X24]
R717  51K  R-EU_5  [R300X100X24]
R718  51K  R-EU_5  [R300X100X24]
R719  51K  R-EU_5  [R300X100X24]
R720  51K  R-EU_5  [R300X100X24]
R721  500  R-EU_2  [R100X86X24]
R722  500  R-EU_2  [R100X86X24]
R723  51K  R-EU_5  [R300X100X24]
R724  51K  R-EU_5  [R300X100X24]

### Nets
+12V: IC701.8(A:V+) IC702.8(A:V+) IC703.8(A:V+) IC704.8(A:V+) IC705.8(A:V+) IC706.8(A:V+) IC707.8(A:V+) IC708.8(A:V+) ; also sheet 2
AGND: C701.P$2 C702.P$2 C703.P$2 C704.P$2 C705.P$2 C706.P$2 C707.P$2 C708.P$2 IC701.4(A:V-) IC702.4(A:V-) IC703.4(A:V-) IC704.4(A:V-) IC705.4(A:V-) IC706.4(A:V-) IC707.4(A:V-) IC708.4(A:V-) R704.P$1 R705.P$1 R706.P$1 R707.P$1 R708.P$1 R709.P$1 R713.P$1 R714.P$1 R715.P$1 R716.P$1 R717.P$1 R718.P$1 R721.P$1 R722.P$1 R723.P$1 R724.P$1 ; also sheet 1,2
AI0: IC701.3(A:IN+) R704.P$2 ; also sheet 1
AI1: IC702.3(A:IN+) R705.P$2 ; also sheet 1
AI2: IC703.3(A:IN+) R706.P$2 ; also sheet 1
AI3: IC704.3(A:IN+) R713.P$2 ; also sheet 1
AI4: IC705.3(A:IN+) R714.P$2 ; also sheet 1
AI5: IC706.3(A:IN+) R715.P$2 ; also sheet 1
AI6: IC707.3(A:IN+) R721.P$2 ; also sheet 1
AI7: IC708.3(A:IN+) R722.P$2 ; also sheet 1
AIN_PUT0: IC701.6(B:-IN) IC701.7(B:OUT) ; also sheet 3
AIN_PUT1: IC702.6(B:-IN) IC702.7(B:OUT) ; also sheet 3
AIN_PUT2: IC703.6(B:-IN) IC703.7(B:OUT) ; also sheet 3
AIN_PUT3: IC704.6(B:-IN) IC704.7(B:OUT) ; also sheet 3
AIN_PUT4: IC705.6(B:-IN) IC705.7(B:OUT) ; also sheet 3
AIN_PUT5: IC706.6(B:-IN) IC706.7(B:OUT) ; also sheet 3
AIN_PUT6: IC707.6(B:-IN) IC707.7(B:OUT) ; also sheet 3
AIN_PUT7: IC708.6(B:-IN) IC708.7(B:OUT) ; also sheet 3
N$32: IC701.1(A:OUT) IC701.2(A:IN-) R701.P$2
N$33: C701.P$1 IC701.5(B:IN+) R701.P$1 R707.P$2
N$42: IC702.1(A:OUT) IC702.2(A:IN-) R702.P$2
N$49: C702.P$1 IC702.5(B:IN+) R702.P$1 R708.P$2
N$55: IC703.1(A:OUT) IC703.2(A:IN-) R703.P$2
N$56: C703.P$1 IC703.5(B:IN+) R703.P$1 R709.P$2
N$57: IC707.1(A:OUT) IC707.2(A:IN-) R719.P$2
N$59: IC704.1(A:OUT) IC704.2(A:IN-) R710.P$2
N$60: C704.P$1 IC704.5(B:IN+) R710.P$1 R716.P$2
N$62: IC705.1(A:OUT) IC705.2(A:IN-) R711.P$2
N$63: C705.P$1 IC705.5(B:IN+) R711.P$1 R717.P$2
N$66: IC706.1(A:OUT) IC706.2(A:IN-) R712.P$2
N$69: C706.P$1 IC706.5(B:IN+) R712.P$1 R718.P$2
N$72: C707.P$1 IC707.5(B:IN+) R719.P$1 R723.P$2
N$76: IC708.1(A:OUT) IC708.2(A:IN-) R720.P$2
N$77: C708.P$1 IC708.5(B:IN+) R720.P$1 R724.P$2

### Buses
AI[0..2],AIN_PUT[0..2]
AI[3..5],AIN_PUT[3..5]
AI[6..7],AIN_PUT[6..7]
AI[0..7],AIN_PUT[0..7]

### Notes on the sheet
- AVR-LPC
- Analog Input
- By The^Day^Of^DooM

## Library data of the parts
C201 C204 C205 C207 C210 C407-C411 C501-C510 = myRcl:CPOL-EU_
C202 C203 C206 C208 C209 C211 C212 C301-C304 C401-C404 C701-C708 = myRcl:C-EU_: CAPACITOR, European symbol
D201-D204 = diode:1N4007
D205 D206 = opto-trans-siemens:SFH205: PHOTO DIODE
D401-D408 = diode:DIODE-: DIODE
D501-D510 = diode:ZENER-DIODE: Z-Diode
F201 = fuse:GSH15: FUSE HOLDER grid 15mm, 19649 Wickmann
I501-I510 = optocoupler:PC814: SHARP OPTO COUPLER
IC201 = v-reg:78XXS: VOLTAGE REGULATOR
IC202 = myV-reg:78XXSC: VOLTAGE REGULATOR
IC401 = myMaxim:MAX232
IC601 IC602 = myLinear:ULN2003A
IC701-IC708 = myLinear:LM358M
IO_CONTROLER LPC = atmel:MEGA32-P: MICROCONTROLLER 32 Kbytes FLASH 2 Kbytes SRAM 1 Kbytes EEPROM USART 8-channel 10 bit ADC Source: www.atmel.com .. doc2503.pdf
K601-K610 = relay:351: RELAY 2 x switch, Omron
L201 = inductors:MICC12: INDUCTOR
Q301 Q401 Q402 = crystal:CRYSTAL: CRYSTAL
R201-R208 R301 R401-R408 R501-R520 R601-R610 R701-R724 = myRcl:R-EU_: RESISTOR, European symbol
SL301 SL403 = con-amp-quick:M07: AMP QUICK CONNECTOR
SL401 = con-amp-quick:M06: AMP QUICK CONNECTOR
SL402 = con-amp-quick:M04: AMP QUICK CONNECTOR
SL404 = con-amp-quick:M08: AMP QUICK CONNECTOR
TR201 = trafo:EI48-1: TRANSFORMER 1 primary winding, 1 secondary winding ERA
VR201 VR202 = v-reg:TL431CLP: VOLTAGE REGULATOR
X101-X108 = con-ptr500:AK500/6: CONNECTOR
X401 = con-thomas-betts:D-SUB9-: D-Subminiatur Connector Source: Electronioc Interconnects European Edition 1998